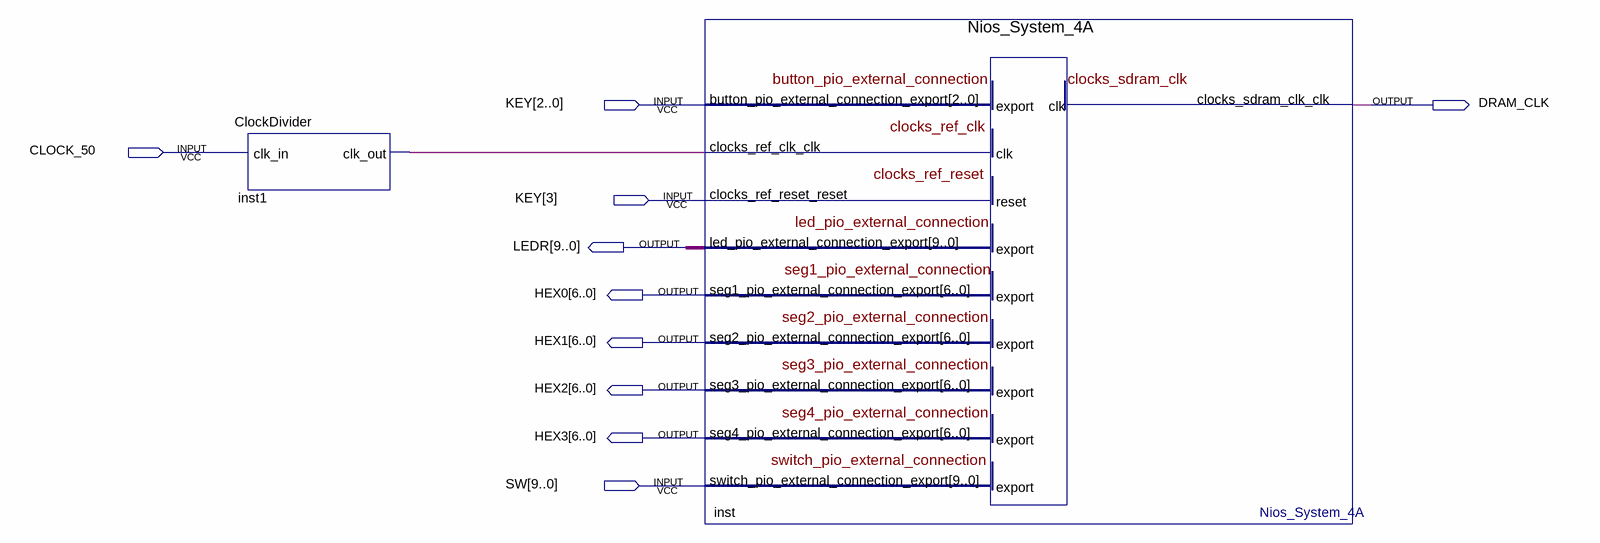
[diagram p0: schematic sheet]
// Quartus schematic Nios_Sys_2A.bdf as structural Verilog: 2 symbols, 10 pins
module Nios_Sys_2A (
  input  [3:0] KEY,
  input  CLOCK_50,
  input  [9:0] SW,
  output DRAM_CLK,
  output [9:0] LEDR,
  output [6:0] HEX0,
  output [6:0] HEX1,
  output [6:0] HEX2,
  output [6:0] HEX3
);

  wire inst1_clk_out;

  ClockDivider inst1 (.clk_in(CLOCK_50), .clk_out(inst1_clk_out));
  Nios_System_4A inst (
    .button_pio_external_connection_export(KEY[2:0]), .clocks_ref_clk_clk(inst1_clk_out),
    .switch_pio_external_connection_export(SW), .clocks_sdram_clk_clk(DRAM_CLK),
    .led_pio_external_connection_export(LEDR), .seg1_pio_external_connection_export(HEX0),
    .seg2_pio_external_connection_export(HEX1), .seg3_pio_external_connection_export(HEX2),
    .seg4_pio_external_connection_export(HEX3));  // open: clocks_ref_reset_reset
endmodule
